# EAGLE design VQFN-16_Breakout (EAGLE 9.6.2)
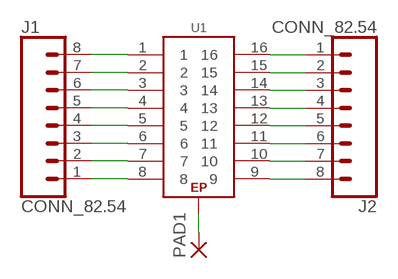
[diagram p0: schematic, sheet 1]

## Parts
J1  CONN_82.54  [1X08]
J2  CONN_82.54  [1X08]
PAD1  SMD2  [SMD1,27-2,54]
U1  GEN_16_EPVQFN-16  [VQFN-16]

## Nets
N$1: PAD1.1(P) U1.EP
N$2: J1.8 U1.1
N$3: J1.7 U1.2
N$4: J1.6 U1.3
N$5: J1.5 U1.4
N$6: J1.4 U1.5
N$7: J1.3 U1.6
N$8: J1.2 U1.7
N$9: J1.1 U1.8
N$10: J2.8 U1.9
N$11: J2.7 U1.10
N$12: J2.6 U1.11
N$13: J2.5 U1.12
N$14: J2.4 U1.13
N$15: J2.3 U1.14
N$16: J2.2 U1.15
N$17: J2.1 U1.16

## Library data of the parts
J1 J2 = bschulz:CONN_8: Genaric 8 terminal header Digikey 2.54_SCREW <https://www.digikey.com/product-detail/en/on-shore-technology-inc/OSTVN06A150/ED10565-ND/1588866>
PAD1 = bschulz:SMD2: SMD PAD; DIGIKEY: N/A; MF: N/A; MPN: DNP
U1 = bschulz:GEN_16_EP: Generic 16 Pin Package for Breakout Boards

## Board
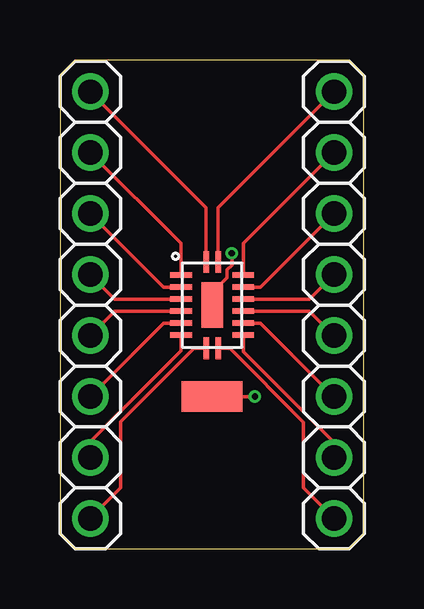
[diagram p1: board, top side]
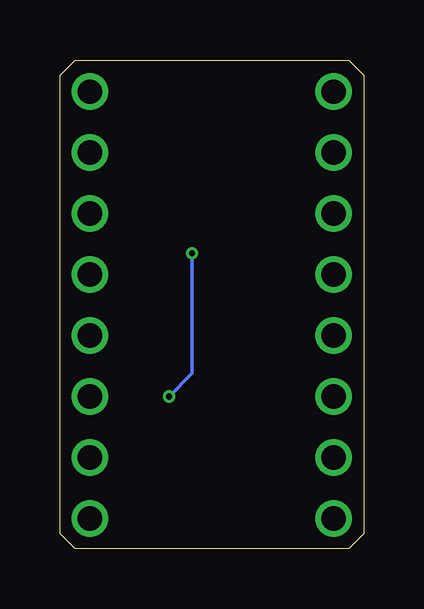
[diagram p2: board, bottom side, seen from below]

Size 12.68 x 20.37 mm. Coordinates in mm from the lower left corner, seen from the top.
Outline: 12.04,20.37 0.64,20.37 0,19.74 0,0.64 0.64,0 12.04,0 12.68,0.64 12.68,19.74 12.04,20.37
Copper layers (1*16): Top 0.035559375mm / dielectric 1.6mm / Bottom 0.035559375mm
Design rules "oshpark-2layer": minimum track width 6mil, minimum drill 10mil, track to track 6mil, track to pad 6mil, pad to pad 6mil, via to via 6mil, smd to smd 6mil, copper to edge 15mil, drill to drill 6mil, minimum pad ring 5mil, minimum via ring 5mil, stop-mask expansion 2.5mil, vias tented up to drill 0mil, thermal gap 10mil

### Footprints (pad centres in the part's own frame; a part is rotated, then mirrored left to right if it is on the bottom)
1X08 = drill 1.016: 1 -8.89,0; 2 -6.35,0; 3 -3.81,0; 4 -1.27,0; 5 1.27,0; 6 3.81,0; 7 6.35,0; 8 8.89,0
SMD1,27-2,54 = smd 1.27 x 2.54: 1 0,0
VQFN-16 = smd 0.9 x 0.24: 1 -1.8,-0.25; 8 1.8,-0.25; 9 1.8,0.25; 16 -1.8,0.25 | smd 0.24 x 0.9: 2 -1.25,-1.3; 3 -0.75,-1.3; 4 -0.25,-1.3; 5 0.25,-1.3; 6 0.75,-1.3; 7 1.25,-1.3; 10 1.25,1.3; 11 0.75,1.3; 12 0.25,1.3; 13 -0.25,1.3; 14 -0.75,1.3; 15 -1.25,1.3 | smd 1.9 x 0.9: EP 0,0

### Placement (x,y rotation side)
J1  1.27,10.16 90 top
J2  11.43,10.16 270 top
PAD1  6.35,6.35 90 top
U1  6.35,10.16 270 top

### Tracks (layer width: path | path; a pad name or v marks a point on that pad's centre or on a via)
N$1  (via drill 0.25)
  Top 0.152: U1.EP 6.35,10.67 6.97,11.29 6.97,11.62 7.17,11.82 v7.17,12.32 | v8.13,6.35 PAD1.1
  Bottom 0.152: v7.17,12.32 7.17,7.31 v8.13,6.35
N$2
  Top 0.152: J1.8 6.1,14.22 U1.1
N$3
  Top 0.152: U1.2 5.05,12.73 J1.7
N$4
  Top 0.152: U1.3 4.33,10.91 J1.6
N$5
  Top 0.152: U1.4 2.29,10.41 J1.5
N$6
  Top 0.152: U1.5 2.29,9.91 J1.4
N$7
  Top 0.152: U1.6 4.33,9.41 J1.3
N$8
  Top 0.152: U1.7 5.05,8.25 1.27,4.47 J1.2
N$9
  Top 0.152: J1.1 2.54,2.54 2.54,5.31 5.59,8.36 U1.8
N$10
  Top 0.152: U1.9 7.08,8.36 10.16,5.28 10.16,2.54 J2.8
N$11
  Top 0.152: U1.10 7.65,8.22 11.43,4.45 J2.7
N$12
  Top 0.152: U1.11 8.37,9.41 J2.6
N$13
  Top 0.152: U1.12 10.41,9.91 J2.5
N$14
  Top 0.152: U1.13 10.41,10.41 J2.4
N$15
  Top 0.152: U1.14 8.37,10.91 J2.3
N$16
  Top 0.152: U1.15 7.65,12.73 J2.2
N$17
  Top 0.152: J2.1 6.6,14.22 U1.16

### Text on the board
tDocu: 1 | 16 | 2 | VQFN-16 | 15 | 3 | 14 | 4 | 13 | 5 | 12 | EP | 6 | 11 | 7 | 10 | Break44 / B. Schulz | 8 | 9